# EAGLE design optocoupler_alarm (EAGLE 8.4.0)
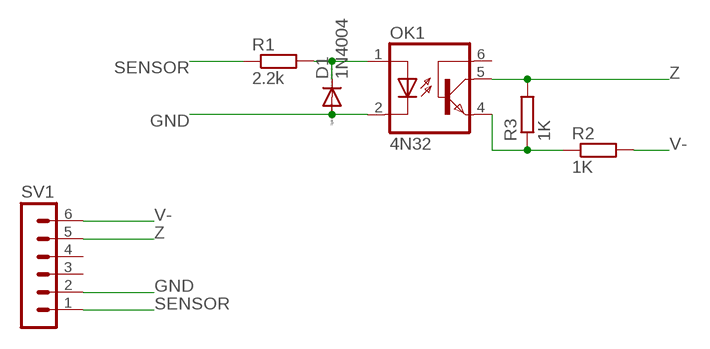
[diagram p0: schematic, sheet 1]

## Parts
D1  1N4004  [DO41-10]
OK1  4N32  4N35M  [DIL06]
R1  2.2k  R-EU_0207/10  [0207/10]
R2  1K  R-EU_0207/10  [0207/10]
R3  1K  R-EU_0207/10  [0207/10]
SV1  MA06-1  [MA06-1]

## Nets
GND: D1.A OK1.2(C) SV1.2
N$2: D1.C OK1.1(A) R1.2
N$6: OK1.4(EMI) R2.1 R3.1
SENSOR: R1.1 SV1.1
V-: R2.2 SV1.6
Z: OK1.5(COL) R3.2 SV1.5
Unconnected: OK1.6(BAS) SV1.3 SV1.4

## Library data of the parts
D1 = diode:1N4004: DIODE general purpose rectifier, 1 A
OK1 = optocoupler:4N*?M: General Purpose 6-Pin Phototransistor Optocouplers Source: http://www.fairchildsemi.com/ds/4N/4N35-M.pdf; MPN: 4N35-M; OC_FARNELL: 1021351; OC_NEWARK: 98K9114
R1-R3 = rcl:R-EU_: RESISTOR, European symbol
SV1 = con-lstb:MA06-1: PIN HEADER; OC_FARNELL: unknown; OC_NEWARK: unknown

## Board
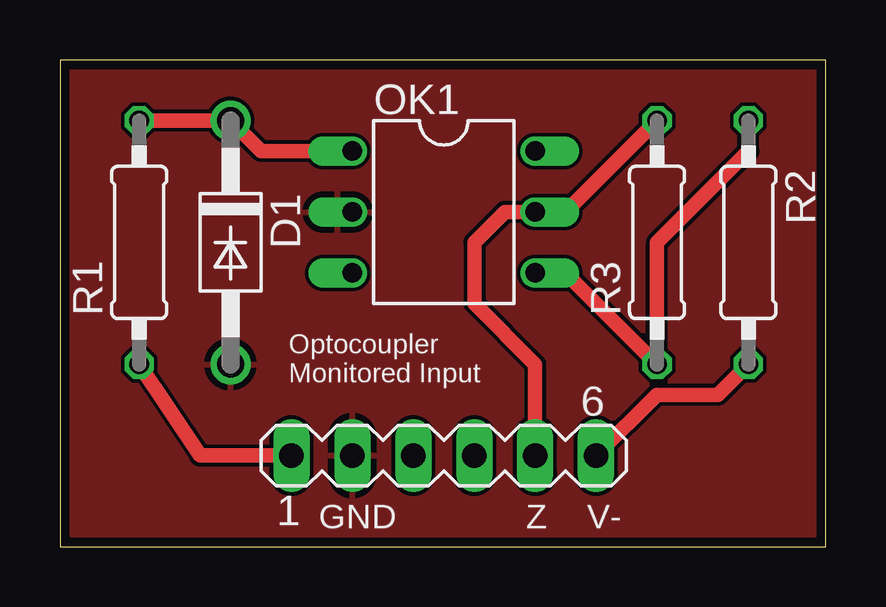
[diagram p1: board, top side]
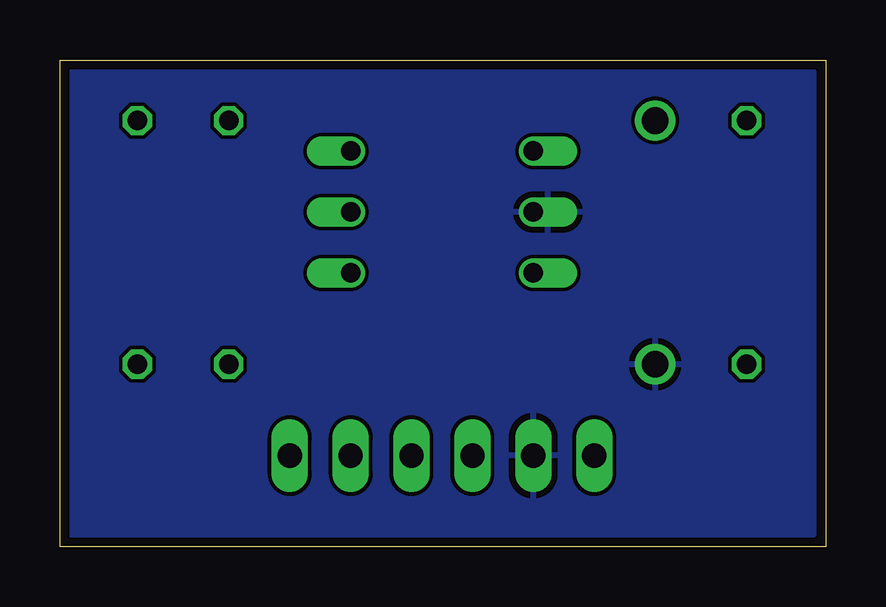
[diagram p2: board, bottom side, seen from below]

Size 31.93 x 20.31 mm. Coordinates in mm from the lower left corner, seen from the top.
Outline: 0,0 31.93,0 31.93,20.31 0,20.31 0,0
Copper layers (1*16): Top 0.035559375mm / dielectric 1.6mm / Bottom 0.035559375mm
Design rules "oshpark-2layer": minimum track width 6mil, minimum drill 10mil, track to track 6mil, track to pad 6mil, pad to pad 6mil, via to via 6mil, smd to smd 6mil, copper to edge 15mil, drill to drill 6mil, minimum pad ring 5mil, minimum via ring 5mil, stop-mask expansion 2.5mil, vias tented up to drill 0mil, thermal gap 10mil

### Footprints (pad centres in the part's own frame; a part is rotated, then mirrored left to right if it is on the bottom)
DO41-10 = drill 1.118: A 5.08,0; C -5.08,0
DIL06 = drill 0.813 offset: 1 -2.54,-3.81; 2 0,-3.81; 3 2.54,-3.81; 4 2.54,3.81; 5 0,3.81; 6 -2.54,3.81
0207/10 = drill 0.813 octagon: 1 -5.08,0; 2 5.08,0
MA06-1 = drill 1.016 long: 1 -6.35,0; 2 -3.81,0; 3 -1.27,0; 4 1.27,0; 5 3.81,0; 6 6.35,0

### Placement (x,y rotation side)
D1  7.11,12.7 270 top
OK1  16,13.97 270 top
R1  3.3,12.7 90 top
R2  28.7,12.7 270 top
R3  24.89,12.7 90 top
SV1  16,3.81 0 top

### Tracks (layer width: path | path; a pad name or v marks a point on that pad's centre or on a via)
GND
  pour Top: 0.51,19.81 31.5,19.81 31.5,0.51 0.51,0.51
  pour Bottom: 0.51,19.81 31.5,19.81 31.5,0.51 0.51,0.51
N$2
  Top 0.61: OK1.1 8.38,16.51 D1.C R1.2
N$6
  Top 0.61: OK1.4 21.08,11.43 R3.1 24.89,12.7 28.7,16.51 R2.1
SENSOR
  Top 0.61: R1.1 5.84,3.81 SV1.1
V-
  Top 0.61: R2.2 27.43,6.35 24.89,6.35 SV1.6
Z
  Top 0.61: R3.2 21.08,13.97 OK1.5 18.54,13.97 17.27,12.7 17.27,10.16 19.81,7.62 SV1.5

### Text on the board
tNames: Optocoupler / Monitored Input | GND | Z | V-